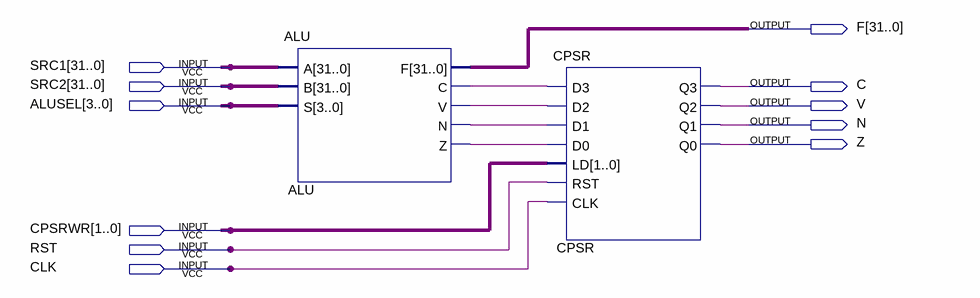
[diagram p0: schematic sheet]
// Quartus schematic execute.bdf as structural Verilog: 2 symbols, 11 pins
module execute (
  input  [31:0] SRC1,
  input  [31:0] SRC2,
  input  [3:0] ALUSEL,
  input  [1:0] CPSRWR,
  input  RST,
  input  CLK,
  output [31:0] F,
  output C,
  output V,
  output N,
  output Z
);

  wire ALU_c, ALU_n, ALU_v, ALU_z;

  ALU ALU (.A(SRC1), .B(SRC2), .S(ALUSEL), .F(F), .C(ALU_c), .V(ALU_v), .N(ALU_n), .Z(ALU_z));
  CPSR CPSR (
    .D3(ALU_c), .D2(ALU_v), .D1(ALU_n), .D0(ALU_z), .LD(CPSRWR), .RST(RST), .CLK(CLK), .Q3(C), .Q2(V),
    .Q1(N), .Q0(Z));
endmodule
